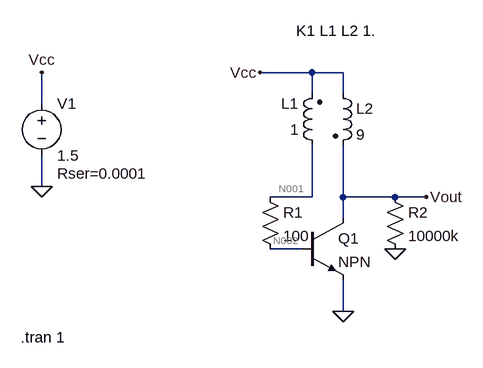
[diagram p0: schematic joule_thief.asc]
joule_thief.asc, the LTspice schematic file:
Version 4
SHEET 1 880 680
WIRE 176 80 96 80
WIRE 224 80 176 80
WIRE 176 112 176 80
WIRE 224 112 224 80
WIRE -240 128 -240 80
WIRE -240 256 -240 208
WIRE 176 272 176 192
WIRE 176 272 112 272
WIRE 224 272 224 192
WIRE 304 272 224 272
WIRE 352 272 304 272
WIRE 224 304 224 272
WIRE 160 352 112 352
WIRE 224 448 224 400
FLAG -240 256 0
FLAG -240 80 Vcc
FLAG 96 80 Vcc
FLAG 224 448 0
FLAG 352 272 Vout
FLAG 304 352 0
SYMBOL ind2 192 208 R180
WINDOW 0 36 80 Left 2
WINDOW 3 36 40 Left 2
SYMATTR InstName L1
SYMATTR Value 1
SYMBOL ind2 208 96 R0
SYMATTR InstName L2
SYMATTR Value 9
SYMBOL voltage -240 112 R0
WINDOW 123 0 0 Left 0
WINDOW 39 24 124 Left 2
SYMATTR SpiceLine Rser=0.0001
SYMATTR InstName V1
SYMATTR Value 1.5
SYMBOL res 96 256 R0
SYMATTR InstName R1
SYMATTR Value 100
SYMBOL npn 160 304 R0
SYMATTR InstName Q1
SYMBOL res 288 256 R0
SYMATTR InstName R2
SYMATTR Value 10000k
TEXT 152 16 Left 2 !K1 L1 L2 1.
TEXT -272 488 Left 2 !.tran 1

The netlist it stands for:
* joule_thief.asc
L1 N001 Vcc 1
L2 Vcc Vout 9
V1 Vcc 0 1.5 Rser=0.0001
R1 N001 N002 100
Q1 Vout N002 0 0 NPN
R2 Vout 0 10000k
.model NPN NPN
.model PNP PNP
.lib standard.bjt
K1 L1 L2 1.
.tran 1
.backanno
.end

* Results of the author's LTspice run, read from the files saved beside the schematic
* Operating Point, zero values left out:
*   V(n001) = 1.5 V
*   V(vcc) = 1.5 V
*   V(vout) = 1.5 V
*   V(n002) = 938 mV
*   Ic(Q1) = 562 mA
*   Ib(Q1) = 5.62 mA
*   Ie(Q1) = -567.6 mA
*   I(L2) = 562 mA
*   I(L1) = -5.62 mA
*   I(R2) = 150 nA
*   I(R1) = 5.62 mA
*   I(V1) = -567.6 mA